# Altium schematic sheet SDRAM.SchDoc
size B
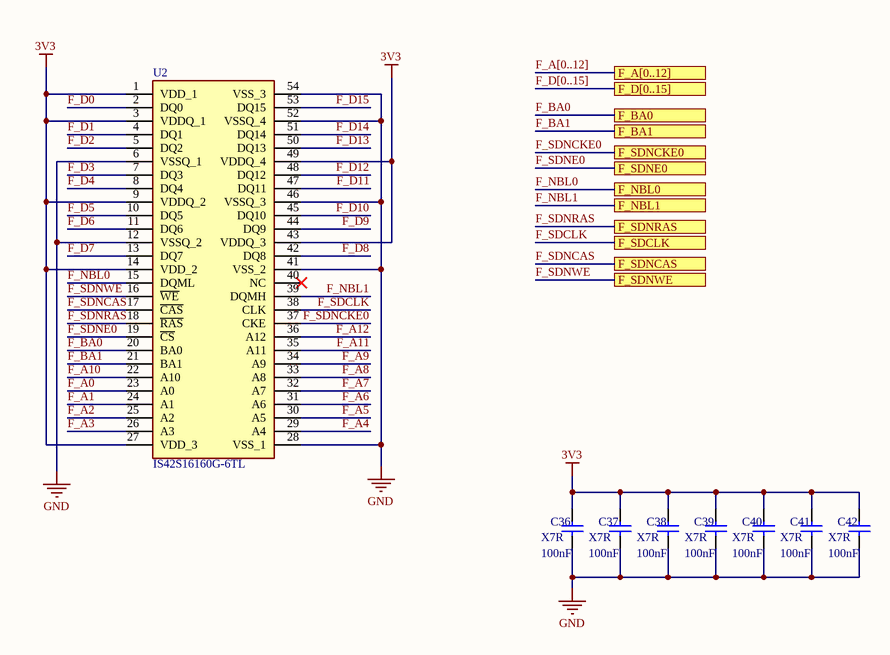
[diagram p0: SDRAM.SchDoc]

## Parts
C36  X7R  value 100nF  [1608[0603]]
C37  X7R  value 100nF  [1608[0603]]
C38  X7R  value 100nF  [1608[0603]]
C39  X7R  value 100nF  [1608[0603]]
C40  X7R  value 100nF  [1608[0603]]
C41  X7R  value 100nF  [1608[0603]]
C42  X7R  value 100nF  [1608[0603]]
U2  IS42S16160G-6TL  [SOP80P1176X120-54N]

## Ports
F_A[0..12], F_BA0, F_BA1, F_D[0..15], F_NBL0, F_NBL1, F_SDCLK, F_SDNCAS, F_SDNCKE0, F_SDNE0, F_SDNRAS, F_SDNWE

## Nets
3V3: C36.2 C37.2 C38.2 C39.2 C40.2 C41.2 C42.2 U2.1(VDD_1) U2.3(VDDQ_1) U2.9(VDDQ_2) U2.14(VDD_2) U2.27(VDD_3) U2.43(VDDQ_3) U2.49(VDDQ_4)
GND: C36.1 C37.1 C38.1 C39.1 C40.1 C41.1 C42.1 U2.6(VSSQ_1) U2.12(VSSQ_2) U2.28(VSS_1) U2.41(VSS_2) U2.46(VSSQ_3) U2.52(VSSQ_4) U2.54(VSS_3)
F_A0: U2.23(A0)
F_A1: U2.24(A1)
F_A2: U2.25(A2)
F_A3: U2.26(A3)
F_A4: U2.29(A4)
F_A5: U2.30(A5)
F_A6: U2.31(A6)
F_A7: U2.32(A7)
F_A8: U2.33(A8)
F_A9: U2.34(A9)
F_A10: U2.22(A10)
F_A11: U2.35(A11)
F_A12: U2.36(A12)
F_BA0: U2.20(BA0) ; port F_BA0
F_BA1: U2.21(BA1) ; port F_BA1
F_D0: U2.2(DQ0)
F_D1: U2.4(DQ1)
F_D2: U2.5(DQ2)
F_D3: U2.7(DQ3)
F_D4: U2.8(DQ4)
F_D5: U2.10(DQ5)
F_D6: U2.11(DQ6)
F_D7: U2.13(DQ7)
F_D8: U2.42(DQ8)
F_D9: U2.44(DQ9)
F_D10: U2.45(DQ10)
F_D11: U2.47(DQ11)
F_D12: U2.48(DQ12)
F_D13: U2.50(DQ13)
F_D14: U2.51(DQ14)
F_D15: U2.53(DQ15)
F_NBL0: U2.15(DQML) ; port F_NBL0
F_NBL1: U2.39(DQMH) ; port F_NBL1
F_SDCLK: U2.38(CLK) ; port F_SDCLK
F_SDNCAS: U2.17(~{CAS}) ; port F_SDNCAS
F_SDNCKE0: U2.37(CKE) ; port F_SDNCKE0
F_SDNE0: U2.19(~{CS}) ; port F_SDNE0
F_SDNRAS: U2.18(~{RAS}) ; port F_SDNRAS
F_SDNWE: U2.16(~{WE}) ; port F_SDNWE

Not connected (* = marked no-connect by the designer): U2 40(NC)*

## Buses and harness runs
bus F_A[0..12] = port F_A[0..12]
bus F_D[0..15] = port F_D[0..15]

## Library data of the parts
C36-C42 = Cap: Capacitor; Published: 8-Jun-2000; LatestRevisionDate: 17-Jul-2002; LatestRevisionNote: Re-released for DXP Platform.; PackageReference: RAD-0.3; Publisher: Altium Limited; PackageDescription: Radial Cap, Thru-Hole; 2 Leads; 0.3 in Pin Spacing
U2 = IS42S16160G-6TL: Integrated Circuit; Manufacturer_Name: Integrated Silicon Solution Inc.; Datasheet Link: http://www.issi.com/WW/pdf/42-45S83200G-16160G.pdf; Height: 1.2mm; Manufacturer_Part_Number: IS42S16160G-6TL; Mouser Part Number: 870-IS42S16160G-6TL; Mouser Price/Stock: https://www.mouser.co.uk/ProductDetail/ISSI/IS42S16160G-6TL?qs=9hm%252BDT1Jr7z36E7PiUiieg%3D%3D; Arrow Part Number: IS42S16160G-6TL; Arrow Price/Stock: https://www.arrow.com/en/products/is42s16160g-6tl/integrated-silicon-solution-inc